# EAGLE design fastkey - v2 (EAGLE 9.2.2)
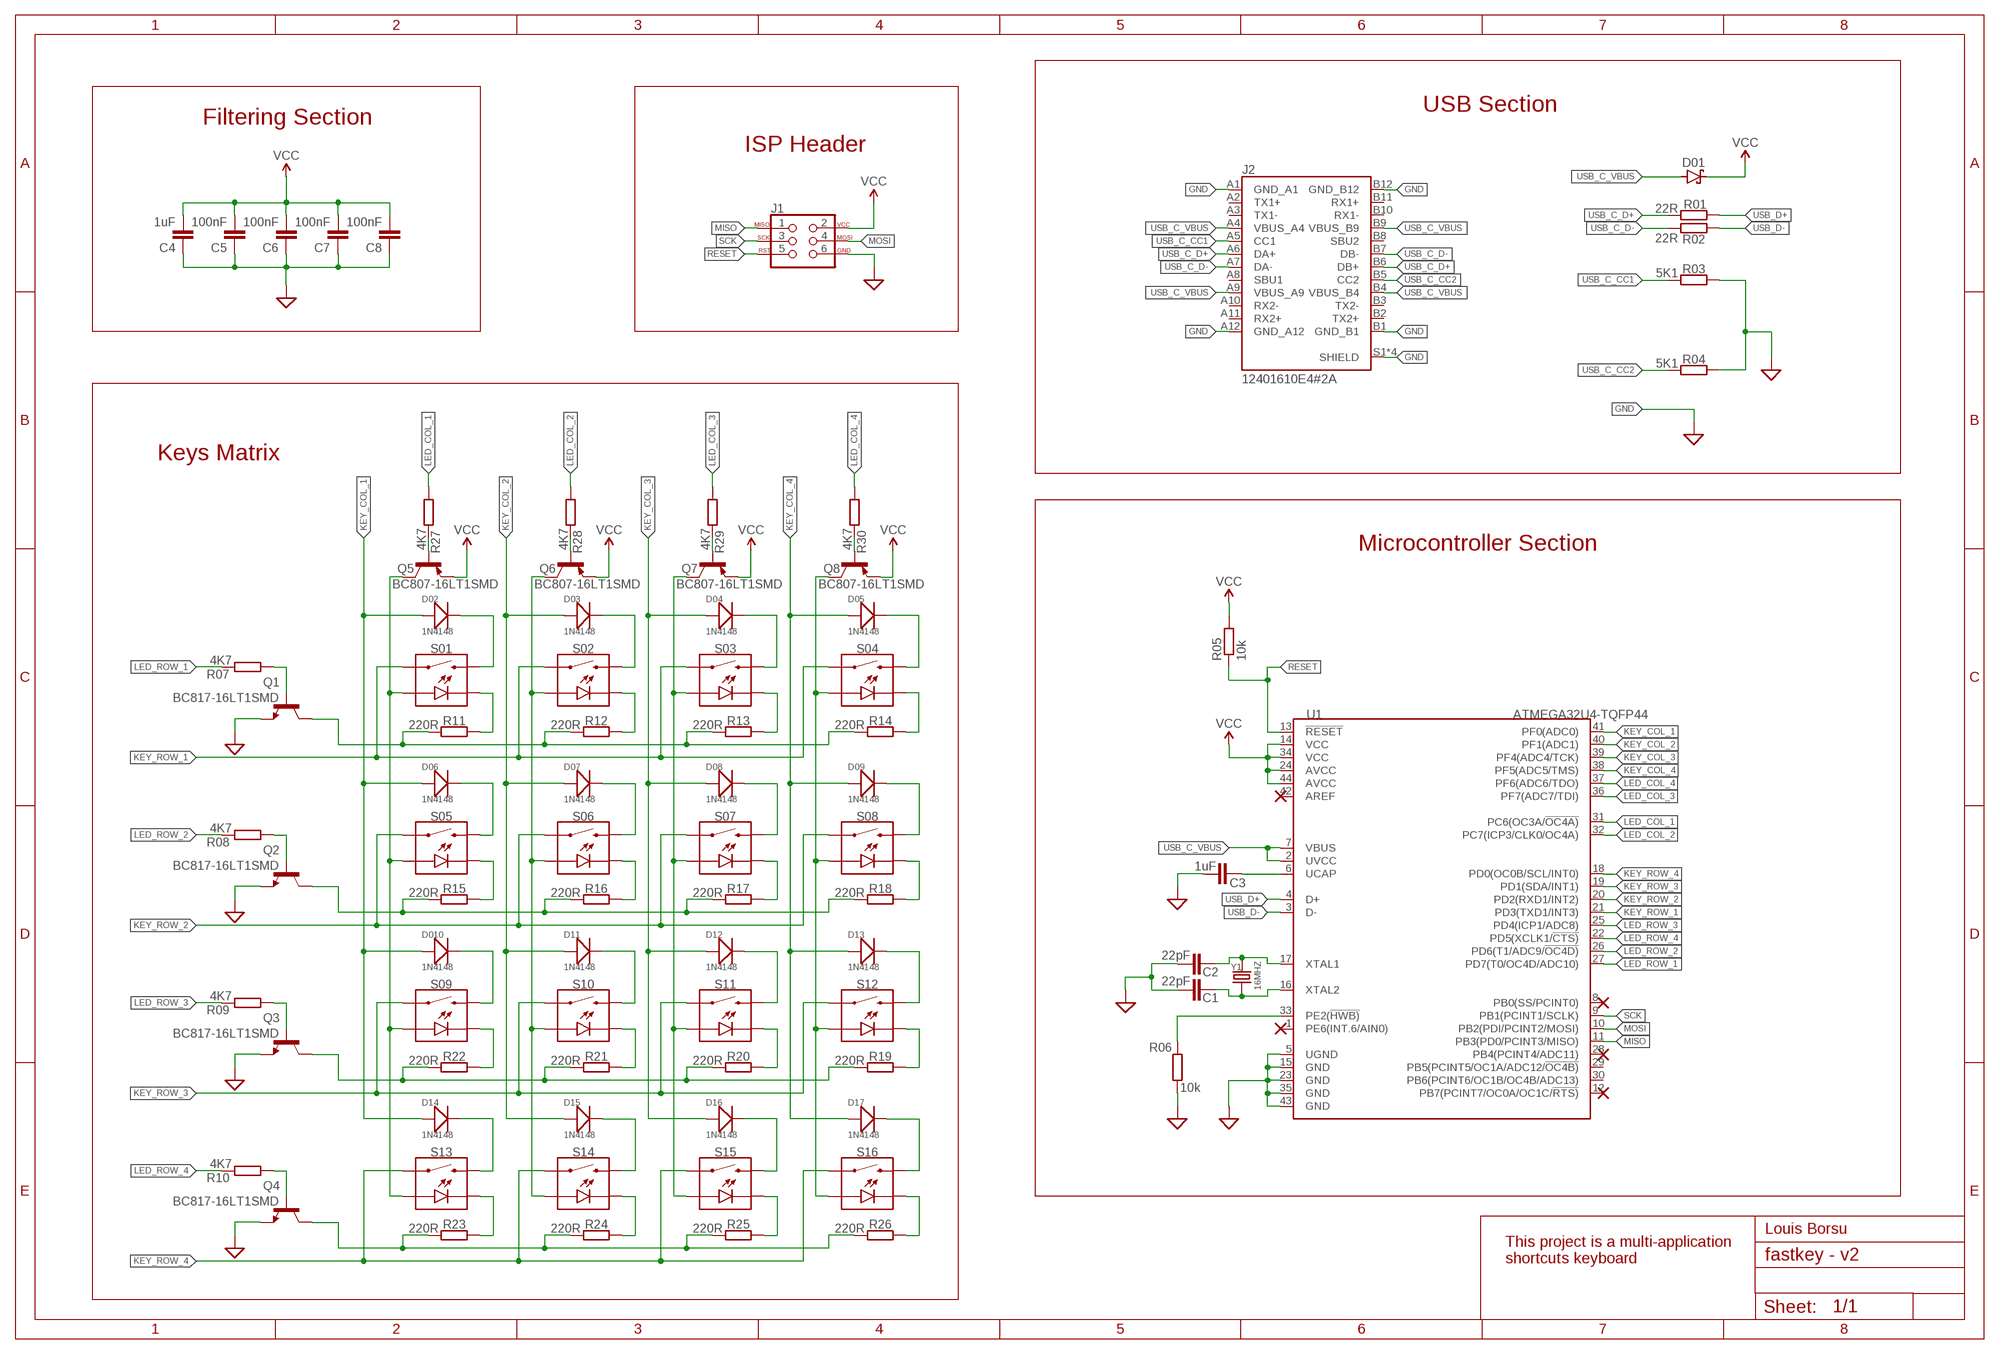
[diagram p0: schematic, sheet 1]

## Parts
C1  22pF  CAPACITOR_0805_M  [RESC0805_M]
C2  22pF  CAPACITOR_0805_M  [RESC0805_M]
C3  1uF  CAPACITOR_0805_M  [RESC0805_M]
C4  1uF  CAPACITOR_0805_M  [RESC0805_M]
C5  100nF  CAPACITOR_0805_M  [RESC0805_M]
C6  100nF  CAPACITOR_0805_M  [RESC0805_M]
C7  100nF  CAPACITOR_0805_M  [RESC0805_M]
C8  100nF  CAPACITOR_0805_M  [RESC0805_M]
D01  SCHOTTKY-DIODESMD  [SMB]
D02  1N4148  SMD-DIODE-SWITCH-1N4148(LL-34)  [LL-34]
D03  1N4148  SMD-DIODE-SWITCH-1N4148(LL-34)  [LL-34]
D04  1N4148  SMD-DIODE-SWITCH-1N4148(LL-34)  [LL-34]
D05  1N4148  SMD-DIODE-SWITCH-1N4148(LL-34)  [LL-34]
D06  1N4148  SMD-DIODE-SWITCH-1N4148(LL-34)  [LL-34]
D07  1N4148  SMD-DIODE-SWITCH-1N4148(LL-34)  [LL-34]
D08  1N4148  SMD-DIODE-SWITCH-1N4148(LL-34)  [LL-34]
D09  1N4148  SMD-DIODE-SWITCH-1N4148(LL-34)  [LL-34]
D010  1N4148  SMD-DIODE-SWITCH-1N4148(LL-34)  [LL-34]
D11  1N4148  SMD-DIODE-SWITCH-1N4148(LL-34)  [LL-34]
D12  1N4148  SMD-DIODE-SWITCH-1N4148(LL-34)  [LL-34]
D13  1N4148  SMD-DIODE-SWITCH-1N4148(LL-34)  [LL-34]
D14  1N4148  SMD-DIODE-SWITCH-1N4148(LL-34)  [LL-34]
D15  1N4148  SMD-DIODE-SWITCH-1N4148(LL-34)  [LL-34]
D16  1N4148  SMD-DIODE-SWITCH-1N4148(LL-34)  [LL-34]
D17  1N4148  SMD-DIODE-SWITCH-1N4148(LL-34)  [LL-34]
J1  AVR_SPI_PROG_3X22X3_LOCK  [2X3_LOCK]
J2  12401610E4#2A  [AMPHENOL_12401610E4#2A]
Q1  BC817-16LT1SMD  [SOT23-BEC]
Q2  BC817-16LT1SMD  [SOT23-BEC]
Q3  BC817-16LT1SMD  [SOT23-BEC]
Q4  BC817-16LT1SMD  [SOT23-BEC]
Q5  BC807-16LT1SMD  [SOT23-BEC]
Q6  BC807-16LT1SMD  [SOT23-BEC]
Q7  BC807-16LT1SMD  [SOT23-BEC]
Q8  BC807-16LT1SMD  [SOT23-BEC]
R01  22R  R-EU_R0805  [R0805]
R02  22R  R-EU_R0805  [R0805]
R03  5K1  R-EU_R0805  [R0805]
R04  5K1  R-EU_R0805  [R0805]
R05  10k  R-EU_R0805  [R0805]
R06  10k  R-EU_R0805  [R0805]
R07  4K7  R-EU_R0805  [R0805]
R08  4K7  R-EU_R0805  [R0805]
R09  4K7  R-EU_R0805  [R0805]
R10  4K7  R-EU_R0805  [R0805]
R11  220R  R-EU_R0805  [R0805]
R12  220R  R-EU_R0805  [R0805]
R13  220R  R-EU_R0805  [R0805]
R14  220R  R-EU_R0805  [R0805]
R15  220R  R-EU_R0805  [R0805]
R16  220R  R-EU_R0805  [R0805]
R17  220R  R-EU_R0805  [R0805]
R18  220R  R-EU_R0805  [R0805]
R19  220R  R-EU_R0805  [R0805]
R20  220R  R-EU_R0805  [R0805]
R21  220R  R-EU_R0805  [R0805]
R22  220R  R-EU_R0805  [R0805]
R23  220R  R-EU_R0805  [R0805]
R24  220R  R-EU_R0805  [R0805]
R25  220R  R-EU_R0805  [R0805]
R26  220R  R-EU_R0805  [R0805]
R27  4K7  R-EU_R0805  [R0805]
R28  4K7  R-EU_R0805  [R0805]
R29  4K7  R-EU_R0805  [R0805]
R30  4K7  R-EU_R0805  [R0805]
S01  MOMENTARY-SWITCH-SPST-LED-PTH-CHERRY  [CHERRY-MX-LED]
S02  MOMENTARY-SWITCH-SPST-LED-PTH-CHERRY  [CHERRY-MX-LED]
S03  MOMENTARY-SWITCH-SPST-LED-PTH-CHERRY  [CHERRY-MX-LED]
S04  MOMENTARY-SWITCH-SPST-LED-PTH-CHERRY  [CHERRY-MX-LED]
S05  MOMENTARY-SWITCH-SPST-LED-PTH-CHERRY  [CHERRY-MX-LED]
S06  MOMENTARY-SWITCH-SPST-LED-PTH-CHERRY  [CHERRY-MX-LED]
S07  MOMENTARY-SWITCH-SPST-LED-PTH-CHERRY  [CHERRY-MX-LED]
S08  MOMENTARY-SWITCH-SPST-LED-PTH-CHERRY  [CHERRY-MX-LED]
S09  MOMENTARY-SWITCH-SPST-LED-PTH-CHERRY  [CHERRY-MX-LED]
S10  MOMENTARY-SWITCH-SPST-LED-PTH-CHERRY  [CHERRY-MX-LED]
S11  MOMENTARY-SWITCH-SPST-LED-PTH-CHERRY  [CHERRY-MX-LED]
S12  MOMENTARY-SWITCH-SPST-LED-PTH-CHERRY  [CHERRY-MX-LED]
S13  MOMENTARY-SWITCH-SPST-LED-PTH-CHERRY  [CHERRY-MX-LED]
S14  MOMENTARY-SWITCH-SPST-LED-PTH-CHERRY  [CHERRY-MX-LED]
S15  MOMENTARY-SWITCH-SPST-LED-PTH-CHERRY  [CHERRY-MX-LED]
S16  MOMENTARY-SWITCH-SPST-LED-PTH-CHERRY  [CHERRY-MX-LED]
U1  ATMEGA32U4-TQFP44  MCU-ATMEGA32U4-AU(TQFP44)  [TQFP44-0.8-9.6X9.6MM]
Y1  16MHZ  SMD-CRYSTAL-16MHZ-8PF-20PPM-40R(2P-5.0X3.2MM)  [X2-SMD-5.0X3.2X1.3MM]

## Nets
GND: C1.1 C2.1 C3.1 C4.1 C5.1 C6.1 C7.1 C8.1 J1.6 J2.A1(GND_A1) J2.A12(GND_A12) J2.B1(GND_B1) J2.B12(GND_B12) J2.S1(SHIELD) J2.S2(SHIELD) J2.S3(SHIELD) J2.S4(SHIELD) Q1.E Q2.E Q3.E Q4.E R03.1 R04.1 R06.1 U1.5(UGND) U1.15(GND) U1.23(GND) U1.35(GND) U1.43(GND) ; supply symbol labelled SUP
KEY_COL_1: D02.A(+) D06.A(+) D010.A(+) D14.A(+) U1.41(PF0(ADC0))
KEY_COL_2: D03.A(+) D07.A(+) D11.A(+) D15.A(+) U1.40(PF1(ADC1))
KEY_COL_3: D04.A(+) D08.A(+) D12.A(+) D16.A(+) U1.39(PF4(ADC4/TCK))
KEY_COL_4: D05.A(+) D09.A(+) D13.A(+) D17.A(+) U1.38(PF5(ADC5/TMS))
KEY_ROW_1: S01.S1 S02.S1 S03.S1 S04.S1 U1.21(PD3(TXD1/INT3))
KEY_ROW_2: S05.S1 S06.S1 S07.S1 S08.S1 U1.20(PD2(RXD1/INT2))
KEY_ROW_3: S09.S1 S10.S1 S11.S1 S12.S1 U1.19(PD1(SDA/INT1))
KEY_ROW_4: S13.S1 S14.S1 S15.S1 S16.S1 U1.18(PD0(OC0B/SCL/INT0))
LED_COL_1: R27.1 U1.31(PC6(OC3A/!OC4A))
LED_COL_1_PR: Q5.C S01.A S05.A S09.A S13.A
LED_COL_2: R28.1 U1.32(PC7(ICP3/CLK0/OC4A))
LED_COL_2_PR: Q6.C S02.A S06.A S10.A S14.A
LED_COL_3: R29.1 U1.36(PF7(ADC7/TDI))
LED_COL_3_PR: Q7.C S03.A S07.A S11.A S15.A
LED_COL_4: R30.1 U1.37(PF6(ADC6/TDO))
LED_COL_4_PR: Q8.C S04.A S08.A S12.A S16.A
LED_ROW_1: R07.2 U1.27(PD7(T0/OC4D/ADC10))
LED_ROW_1_PR: Q1.C R11.2 R12.2 R13.2 R14.2
LED_ROW_2: R08.2 U1.26(PD6(T1/ADC9/!OC4D))
LED_ROW_2_PR: Q2.C R15.2 R16.2 R17.2 R18.2
LED_ROW_3: R09.2 U1.25(PD4(ICP1/ADC8))
LED_ROW_3_PR: Q3.C R19.2 R20.2 R21.2 R22.2
LED_ROW_4: R10.2 U1.22(PD5(XCLK1/!CTS))
LED_ROW_4_PR: Q4.C R23.2 R24.2 R25.2 R26.2
MISO: J1.1 U1.11(PB3(PD0/PCINT3/MISO))
MOSI: J1.4 U1.10(PB2(PDI/PCINT2/MOSI))
N$1: C2.2 U1.17(XTAL1) Y1.2
N$2: R11.1 S01.K(C)
N$3: R12.1 S02.K(C)
N$4: R24.1 S14.K(C)
N$5: R25.1 S15.K(C)
N$6: C1.2 U1.16(XTAL2) Y1.1
N$7: R26.1 S16.K(C)
N$8: R19.1 S12.K(C)
N$9: R20.1 S11.K(C)
N$10: R21.1 S10.K(C)
N$11: D02.C(-) S01.S2
N$12: R22.1 S09.K(C)
N$13: R15.1 S05.K(C)
N$14: R16.1 S06.K(C)
N$15: R17.1 S07.K(C)
N$16: R18.1 S08.K(C)
N$17: R14.1 S04.K(C)
N$18: R13.1 S03.K(C)
N$19: Q1.B R07.1
N$20: Q2.B R08.1
N$21: C3.2 U1.6(UCAP)
N$22: R06.2 U1.33(PE2(!HWB))
N$23: Q5.B R27.2
N$24: Q6.B R28.2
N$25: Q7.B R29.2
N$26: D04.C(-) S03.S2
N$27: Q8.B R30.2
N$28: Q3.B R09.1
N$29: R23.1 S13.K(C)
N$30: Q4.B R10.1
N$36: D03.C(-) S02.S2
N$39: D05.C(-) S04.S2
N$44: D06.C(-) S05.S2
N$45: D07.C(-) S06.S2
N$46: D08.C(-) S07.S2
N$47: D09.C(-) S08.S2
N$48: D010.C(-) S09.S2
N$50: D11.C(-) S10.S2
N$51: D15.C(-) S14.S2
N$53: D12.C(-) S11.S2
N$54: D14.C(-) S13.S2
N$55: D16.C(-) S15.S2
N$56: D13.C(-) S12.S2
N$57: D17.C(-) S16.S2
RESET: J1.5 R05.1 U1.13(!RESET)
SCK: J1.3 U1.9(PB1(PCINT1/SCLK))
USB_C_CC1: J2.A5(CC1) R03.2
USB_C_CC2: J2.B5(CC2) R04.2
USB_C_D+: J2.A6(DA+) J2.B6(DB+) R01.2
USB_C_D-: J2.A7(DA-) J2.B7(DB-) R02.2
USB_C_VBUS: D01.A J2.A4(VBUS_A4) J2.A9(VBUS_A9) J2.B4(VBUS_B4) J2.B9(VBUS_B9) U1.2(UVCC) U1.7(VBUS)
USB_D+: R01.1 U1.4(D+)
USB_D-: R02.1 U1.3(D-)
VCC [VCC]: C4.2 C5.2 C6.2 C7.2 C8.2 D01.C J1.2 Q5.E Q6.E Q7.E Q8.E R05.2 U1.14(VCC) U1.24(AVCC) U1.34(VCC) U1.44(AVCC)
Unconnected: J2.A2(TX1+) J2.A3(TX1-) J2.A8(SBU1) J2.A10(RX2-) J2.A11(RX2+) J2.B2(TX2+) J2.B3(TX2-) J2.B8(SBU2) J2.B10(RX1-) J2.B11(RX1+) U1.1(PE6(INT.6/AIN0)) U1.8(PB0(SS/PCINT0)) U1.12(PB7(PCINT7/OC0A/OC1C/!RTS)) U1.28(PB4(PCINT4/ADC11)) U1.29(PB5(PCINT5/OC1A/ADC12/!OC4B)) U1.30(PB6(PCINT6/OC1B/OC4B/ADC13)) U1.42(AREF)

## Notes on the sheet
- USB Section
- Filtering Section
- ISP Header
- Keys Matrix
- Microcontroller Section
- Louis Borsu
- This project is a multi-application
  shortcuts keyboard

## Library data of the parts
C1-C5 C7 C8 = Nordic_nRF:CAPACITOR: Generic chip capacitor; SPICEPREFIX: C
C6 = Nordic_nRF:CAPACITOR: Generic chip capacitor
D01 = diode:SCHOTTKY-DIODE: Schottky Diode
D02-D010 D11-D17 = Seeed-Diode:SMD-DIODE-SWITCH-1N4148(LL-34): 304040016; MPN: 1N4148
J1 = SparkFun-Connectors:AVR_SPI_PROG_3X2: AVR ISP 6 Pin This is the reduced ISP connector for AVR programming. Common on Arduino. This footprint will take up less PCB space and can be used with a 10-pin to 6-pin adapter such as SKU: BOB-08508 **Special note about "TEST_POINT" package. The stop mask is on the top side, so if you want your programming test points to be on the bottom of your board, make sure to place this package on the bottom side of the board. This also ensure that the orientation to program from the bottom side will be correct. SparkFun Products: SparkFun ISP Pogo Adapter <https://www.sparkfun.com/products/11591> - NS Tiny AVR Programmer <https://www.sparkfun.com/products/11801> -PTH
J2 = 12401610E4_2A:12401610E4#2A: Usb Type-c, Ra Rcpt, Pcb Mount,; DESCRIPTION: Conn USB Type C Surface Mount Receptacle; DIGI-KEY_PART_NUMBER: 12401610E4#2ACT-ND; DIGI-KEY_PURCHASE_URL: https://www.digikey.com/product-detail/en/amphenol-icc-commercial-products/12401610E4-2A/12401610E4-2ACT-ND/5775520?utm_source=snapeda&utm_medium=aggregator&utm_campaign=symbol; MF: Amphenol ICC; MP: 12401610E4#2A; PACKAGE: None
Q1-Q4 = transistor-npn:BC817*: NPN Transistor
Q5-Q8 = transistor-pnp:BC807*: PNP Transistror
R01-R09 R10-R30 = rcl:R-EU_: RESISTOR, European symbol; SPICEPREFIX: R
S01-S09 S10-S16 = SparkFun-Switches:MOMENTARY-SWITCH-SPST-LED: Momentary Switch (Pushbutton) - SPST - w/ LED Normally-open (NO) SPST momentary switches (buttons, pushbuttons), with a built-in LED. Variants PTH-CHERRY - Cherry MX Switch Cherry MX Keyswitches are top-of-the-line mechanical keyboard switches. They’re satisfyingly “clicky”, reliable up to tens-of-millions of key presses, and a standard in gaming and programming keyboards across the globe. This ‘blue’ version Cherry MX Switch is favored by most due to its secondary internal actuator making it less likely to “double-tap.” If you are looking for a noticeably audible and high-quality key switch, this is the perfect option for you! Cherry MX Switch <https://www.sparkfun.com/products/13834> (COM-13834) Cherry MX Switch Breakout <https://www.sparkfun.com/products/13773> (BOB-13773) PTH-12MM and PTH-12MM-KIT - 12mm Illuminated LED KIT variant is for soldering kits. There is no tStop (covering up the top side of the pads with mask). This helps the beginner see which side they should be soldering too. LED Tactile Button Breakout <https://www.sparkfun.com/products/10467> (BOB-10467) LED Tactile Button - Red <https://www.sparkfun.com/products/10442> (COM-10442) LED Tactile Button - Blue <https://www.sparkfun.com/products/10443> (COM-10443) LED Tactile Button - Green <https://www.sparkfun.com/products/10440> (COM-10440) LED Tactile Button - Orange <https://www.sparkfun.com/products/10441> (COM-10441) LED Tactile Button - White <https://www.sparkfun.com/products/10439> (COM-10439); SF_ID: COM-13834
U1 = Seeed-IC:MCU-ATMEGA32U4-AU(TQFP44): 310010010; MPN: ATMEGA32U4
Y1 = Seeed-Crystal Oscillator:SMD-CRYSTAL-16MHZ-8PF-20PPM-40R(2P-5.0X3.2MM): 306010054; MPN: X053201602002

## Net classes
1 VCC: width 0.406 mm

## Board
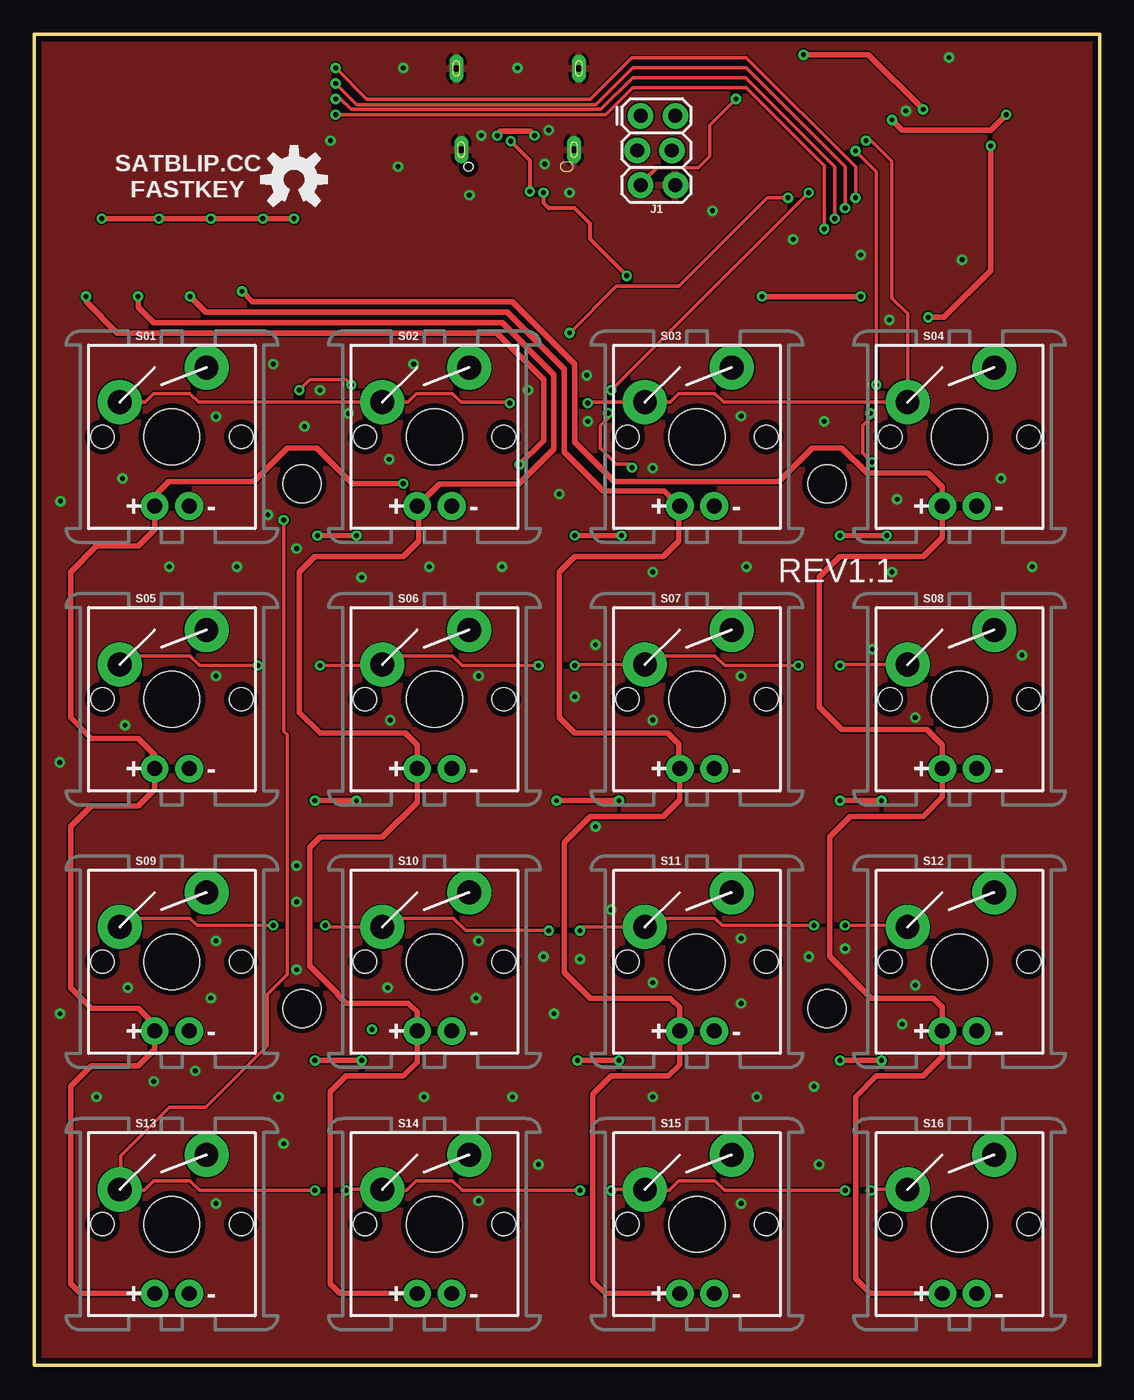
[diagram p1: board, top side]
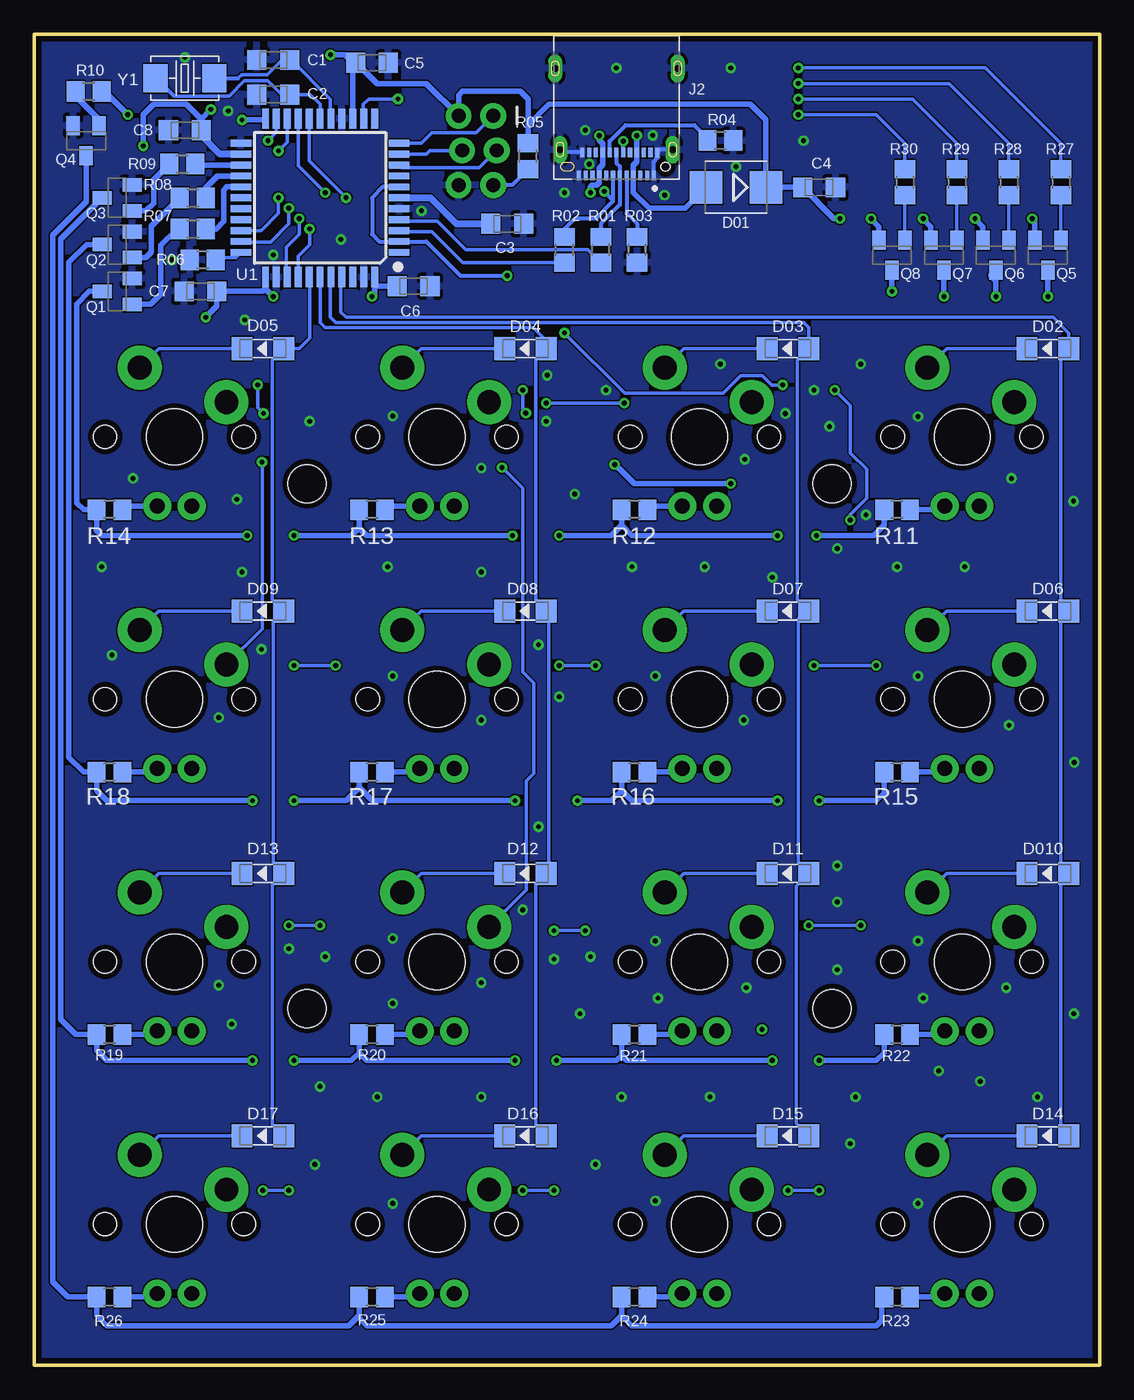
[diagram p2: board, bottom side, seen from below]

Size 78.11 x 97.6 mm. Coordinates in mm from the lower left corner, seen from the top.
Outline: 0,0 78.11,0 78.11,97.6 0,97.6 0,0
Copper layers (1*16): Top 0.035mm / dielectric 1.5mm / Bottom 0.035mm
Design rules "default *": minimum track width 3.5mil, minimum drill 0.2mm, track to track 4mil, track to pad 5mil, pad to pad 5mil, via to via 5mil, smd to smd 4mil, copper to edge 0.4mm, drill to drill 6mil, minimum pad ring 10mil, minimum via ring 8mil, stop-mask expansion 4mil, vias tented up to drill 14mil, thermal gap 10mil
Holes 2.79 mm at 19.62,64.64 58.1,64.64 19.62,26.16 58.1,26.16

### Footprints (pad centres in the part's own frame; a part is rotated, then mirrored left to right if it is on the bottom)
RESC0805_M = smd 1.4 x 1.45: 1 -1.2,0; 2 1.2,0
SMB = smd 2.4 x 2.4: A 2.2,0; C -2.2,0
LL-34 = smd 1.524 x 1.676: A -1.524,0; C 1.524,0
2X3_LOCK = drill 1.016 pad 1.88: 1 0,0.127; 2 0,2.667; 3 2.54,-0.127; 4 2.54,2.413; 5 5.08,0.127; 6 5.08,2.667
AMPHENOL_12401610E4#2A = smd 0.3 x 0.7: A1 -2.75,0.66; A2 -2.25,0.66; A3 -1.75,0.66; A4 -1.25,0.66; A5 -0.75,0.66; A6 -0.25,0.66; A7 0.25,0.66; A8 0.75,0.66; A9 1.25,0.66; A10 1.75,0.66; A11 2.25,0.66; A12 2.75,0.66; B1 2.5,-1.04; B2 2,-1.04; B3 1.5,-1.04; B4 1,-1.04; B5 0.5,-1.04; B6 0,-1.04; B7 -0.5,-1.04; B8 -1,-1.04; B9 -1.5,-1.04; B10 -2,-1.04; B11 -2.5,-1.04; B12 -3,-1.04 | drill 0.5 pad 0.8 long: S1 -4.13,-1.25; S2 4.13,-1.25; S3 4.49,-7.2; S4 -4.49,-7.2 | hole 0.65: -3.6,0
SOT23-BEC = smd 1 x 1.4: B -0.95,-1.1; C 0,1.1; E 0.95,-1.1
R0805 = smd 1.3 x 1.5: 1 -0.95,0; 2 0.95,0
CHERRY-MX-LED = drill 1.092 pad 2.032: A -1.27,-5.08; K 1.27,-5.08 | drill 1.753 pad 3.226: S1 -3.81,2.54; S2 2.54,5.08 | hole 4.089: 0,0 | hole 1.707: -5.08,0; 5.08,0
TQFP44-0.8-9.6X9.6MM = smd 1.5 x 0.5: 1 -5.8,4; 2 -5.8,3.2; 3 -5.8,2.4; 4 -5.8,1.6; 5 -5.8,0.8; 6 -5.8,0; 7 -5.8,-0.8; 8 -5.8,-1.6; 9 -5.8,-2.4; 10 -5.8,-3.2; 11 -5.8,-4; 23 5.8,-4; 24 5.8,-3.2; 25 5.8,-2.4; 26 5.8,-1.6; 27 5.8,-0.8; 28 5.8,0; 29 5.8,0.8; 30 5.8,1.6; 31 5.8,2.4; 32 5.8,3.2; 33 5.8,4 | smd 0.5 x 1.5: 12 -4,-5.8; 13 -3.2,-5.8; 14 -2.4,-5.8; 15 -1.6,-5.8; 16 -0.8,-5.8; 17 0,-5.8; 18 0.8,-5.8; 19 1.6,-5.8; 20 2.4,-5.8; 21 3.2,-5.8; 22 4,-5.8; 34 4,5.8; 35 3.2,5.8; 36 2.4,5.8; 37 1.6,5.8; 38 0.8,5.8; 39 0,5.8; 40 -0.8,5.8; 41 -1.6,5.8; 42 -2.4,5.8; 43 -3.2,5.8; 44 -4,5.8
X2-SMD-5.0X3.2X1.3MM = smd 1.778 x 2.032: 1 -2.159,0; 2 2.159,0

### Placement (x,y rotation side)
C1  60.59,95.71 0 bottom
C2  60.59,93.16 0 bottom
C3  43.43,83.69 180 bottom
C4  20.57,86.36 180 bottom
C5  53.34,95.5 180 bottom
C6  50.29,79.12 180 bottom
C7  65.91,78.74 0 bottom
C8  67.06,90.55 0 bottom
D01  26.67,86.36 180 bottom
D02  3.81,74.55 180 bottom
D03  22.86,74.55 180 bottom
D04  42.1,74.55 180 bottom
D05  61.34,74.55 180 bottom
D06  3.81,55.31 180 bottom
D07  22.86,55.31 180 bottom
D08  42.1,55.31 180 bottom
D09  61.34,55.31 180 bottom
D010  3.81,36.07 180 bottom
D11  22.86,36.07 180 bottom
D12  42.1,36.07 180 bottom
D13  61.34,36.07 180 bottom
D14  3.81,16.83 180 bottom
D15  22.86,16.83 180 bottom
D16  42.1,16.83 180 bottom
D17  61.34,16.83 180 bottom
J1  44.33,91.61 270 top
J2  35.43,87.88 180 bottom
Q1  72.01,78.74 90 bottom
Q2  72.01,82.17 90 bottom
Q3  72.01,85.6 90 bottom
Q4  74.3,89.79 180 bottom
Q5  3.81,81.41 180 bottom
Q6  7.62,81.41 180 bottom
Q7  11.43,81.41 180 bottom
Q8  15.24,81.41 180 bottom
R01  36.58,81.79 90 bottom
R02  39.24,81.79 90 bottom
R03  33.91,81.79 90 bottom
R04  27.81,89.79 180 bottom
R05  41.91,88.65 90 bottom
R06  65.75,81.06 0 bottom
R07  66.48,83.31 0 bottom
R08  66.48,85.6 0 bottom
R09  67.25,88.07 0 bottom
R10  74.1,93.41 0 bottom
R11  14.86,62.74 180 bottom
R12  34.1,62.74 180 bottom
R13  53.34,62.74 180 bottom
R14  72.58,62.74 180 bottom
R15  14.86,43.5 180 bottom
R16  34.1,43.5 180 bottom
R17  53.34,43.5 180 bottom
R18  72.58,43.5 180 bottom
R19  72.58,24.26 180 bottom
R20  53.34,24.26 180 bottom
R21  34.1,24.26 180 bottom
R22  14.86,24.26 180 bottom
R23  14.86,5.02 180 bottom
R24  34.1,5.02 180 bottom
R25  53.34,5.02 180 bottom
R26  72.58,5.02 180 bottom
R27  2.86,86.74 270 bottom
R28  6.67,86.74 270 bottom
R29  10.48,86.74 270 bottom
R30  14.29,86.74 270 bottom
S01  10.1,68.07 0 top
S02  29.34,68.07 0 top
S03  48.58,68.07 0 top
S04  67.82,68.07 0 top
S05  10.1,48.83 0 top
S06  29.34,48.83 0 top
S07  48.58,48.83 0 top
S08  67.82,48.83 0 top
S09  10.1,29.59 0 top
S10  29.34,29.59 0 top
S11  48.58,29.59 0 top
S12  67.82,29.59 0 top
S13  10.1,10.35 0 top
S14  29.34,10.35 0 top
S15  48.58,10.35 0 top
S16  67.82,10.35 0 top
U1  57.15,85.6 180 bottom
U$1  [OSHW-LOGO-M]  19.05,86.93 0 top
Y1  67.06,94.36 180 bottom

### Tracks (layer width: path | path; a pad name or v marks a point on that pad's centre or on a via)
GND  (via drill 0.35)
  Bottom 0.305: J2.B1 39.35,88.92 J2.S2 | J2.S1 32.22,89.13 J2.B12 32.38,88.88 32.38,88.56 32.68,88.26 J2.A1
  other vias: 55.63,82.55 62.67,76.64 6.48,65.02 13.33,69.56 19.81,68.83 26.03,66.43 27.81,73.41 17.53,73.41 9.91,58.55 14.86,58.55 19.24,59.88 24,57.78 28.96,58.55 34.29,58.55 38.48,63.88 45.34,58.17 52.2,58.55 45.34,65.79 57.91,69.22 40.58,69.22 39.62,49.02 6.67,46.93 13.34,50.55 26.1,47.31 32.58,50.55 45.34,47.31 51.82,50.55 64.58,47.5 51.82,69.6 20.95,71.5 6.86,27.69 12.95,26.92 13.34,31.11 11.81,21.59 8.76,20.83 4.57,19.68 17.91,19.68 18.29,16.26 28.57,19.68 35.05,19.68 36.96,14.73 38.1,25.78 37.34,29.97 32.58,31.11 25.91,27.69 32.38,26.92 45.34,19.68 52.96,19.68 57.15,20.45 57.53,14.73 45.34,28.07 51.82,31.31 51.82,26.54 56.77,29.97 63.63,25.02 19.24,29.02 40.01,29.78 59.44,30.54 64.58,27.88 13.34,11.87 32.58,12.06 51.82,11.87 19.24,36.64 19.24,33.97 27.05,95.12 35.43,95.12 37.72,90.55 26.67,87.88 21.72,89.79 32.77,90.17 39.24,85.98 31.9,85.79 49.72,84.65 63.25,63.5 70.87,65.02 73.15,58.55 62.87,58.17 72.39,52.07 60.58,81.41 68.01,81.06 67.06,95.88 63.89,91.96 1.94,63.36 1.88,44.21 1.91,25.78 41.15,52.83 41.15,39.5 42.29,33.4 36.2,71.5 40.5,72.59 61.44,52.5 17.14,62.36 37.43,88.07 23.05,69.79
  pour Bottom: -0.76,98.17 79.06,98.17 79.06,-0.89 -0.76,-0.89
  pour Top: -0.76,98.17 79.06,98.17 79.06,-0.89 -0.76,-0.89
KEY_COL_1
  Bottom 0.254: U1.41 55.63,79.72 55.63,77.22 55.24,76.83 3.43,76.83 2.29,75.69 D02.A 2.86,73.98 2.86,55.88 D06.A 2.86,54.74 2.86,36.64 D010.A 2.86,35.5 2.86,17.4 D14.A
KEY_COL_2
  Bottom 0.254: U1.40 56.39,79.76 56.39,76.83 56.01,76.45 21.72,76.45 21.34,76.07 D03.A 22.18,73.7 22.18,56.15 D07.A 21.53,55.31 22.1,54.74 22.1,36.83 D11.A 22.25,35.16 22.25,17.74 D15.A
KEY_COL_3
  Bottom 0.254: U1.39 57.15,76.45 56.77,76.07 41.53,76.07 40.58,75.12 D04.A 41.34,73.79 41.34,56.07 D08.A 40.39,55.12 40.39,36.26 D12.A 41.34,35.31 41.34,17.59 D16.A
KEY_COL_4
  Bottom 0.254: U1.38 57.91,79.76 57.91,75.31 58.67,74.55 D05.A 60.66,73.71 60.66,56.15 D09.A 60.58,54.55 60.58,36.83 D13.A 60.64,35.24 60.64,17.65 D17.A
KEY_ROW_1  (via drill 0.35)
  Top 0.254: S01.S1 8.13,70.61 8.78,71.26 11.42,71.26 12.06,70.61 S02.S1 27.37,70.61 28.02,71.26 30.66,71.26 31.3,70.61 34.8,70.61 v34.86,70.55 | v40.58,70.55 40.64,70.61 S03.S1 46.61,70.61 47.26,71.26 49.9,71.26 50.55,70.61 S04.S1 64.01,77.09 62.87,78.23 62.87,88.27 61.34,89.79 v60.96,89.79
  Bottom 0.254: v34.86,70.55 v40.58,70.55 | v60.96,89.79 60.35,90.4 U1.21
KEY_ROW_2  (via drill 0.35)
  Top 0.254: S08.S1 59.12,51.37 v59.05,51.31 | v56.01,51.31 50.61,51.31 49.9,52.02 45.35,52.02 44.77,51.44 S07.S1 39.69,51.37 v39.62,51.31 | v36.96,51.31 31.37,51.31 30.66,52.02 26.11,52.02 25.53,51.44 S06.S1 25.46,51.31 v20.95,51.31 | v16.38,51.31 12.13,51.31 11.42,52.02 6.87,52.02 6.29,51.44 S05.S1 | v60.2,89.03 61.72,87.5 v61.72,71.88 | v61.29,69.8 61.29,69.44 60.74,68.9 60.74,66.89 v61.4,66.23
  Bottom 0.254: v59.05,51.31 v56.01,51.31 | v39.62,51.31 v36.96,51.31 | v20.95,51.31 v16.38,51.31 | v60.2,89.03 59.55,89.67 U1.20 | v61.72,71.88 61.72,70.23 v61.29,69.8 | v61.4,66.23 61.4,53.98 S08.S1
KEY_ROW_3  (via drill 0.35)
  Top 0.254: S12.S1 63.88,32.26 v59.44,32.26 | v57.15,32.26 50.42,32.26 49.9,32.78 45.41,32.78 S11.S1 40.26,32.13 v40.01,31.88 | v37.72,31.88 31.62,31.88 30.72,32.78 26.11,32.78 25.53,32.19 S10.S1 21.46,32.13 v21.34,32.26 | v17.53,32.26 11.94,32.26 11.42,32.78 6.93,32.78 S09.S1 | v56.77,85.98 v42.29,71.5 | v42.07,69.82 42.07,69.47 41.5,68.9 41.5,67.25 42.67,66.08 43.56,66.08 v43.81,65.82
  Bottom 0.254: v59.44,32.26 v57.15,32.26 | v40.01,31.88 v37.72,31.88 | v21.34,32.26 v17.53,32.26 | U1.19 58.75,87.96 v56.77,85.98 | v42.29,71.5 42.29,70.04 v42.07,69.82 | v43.81,65.82 42.29,64.3 42.29,50.83 41.5,50.04 41.5,43.39 42.04,42.86 42.04,34.86 S11.S1
KEY_ROW_4  (via drill 0.35)
  Top 0.254: S16.S1 61.4,12.89 v61.34,12.83 | v59.44,12.83 50.61,12.83 49.9,13.54 47.26,13.54 46.55,12.83 44.83,12.83 S15.S1 42.35,12.89 v42.29,12.83 | v40.01,12.83 31.37,12.83 30.66,13.54 28.02,13.54 27.3,12.83 25.59,12.83 S14.S1 22.92,12.89 v22.86,12.83 | 6.35,12.83 S13.S1 | v20.57,12.83 12.13,12.83 11.42,13.54 8.78,13.54 8.06,12.83 6.35,12.83 | v55.24,85.6 53.72,85.6 47.24,79.12 42.67,79.12 v39.24,75.69 | v23.24,71.88 22.86,72.26 20.19,72.26 v19.43,71.5 | v18.29,61.98 18.29,46.49 18.54,46.24 18.54,28.67 17.08,27.21 17.08,23.43 12.57,18.92 9.91,18.92 6.35,15.37 6.35,12.83
  Bottom 0.254: v61.34,12.83 v59.44,12.83 | v42.29,12.83 v40.01,12.83 | v22.86,12.83 v20.57,12.83 | U1.18 57.95,88.3 v55.24,85.6 | v23.24,71.88 24.05,71.88 24.74,72.57 26.32,72.57 27.62,71.27 34.82,71.27 v39.24,75.69 | v19.43,71.5 18.29,70.36 18.29,66.9 17.08,65.69 17.08,63.59 18.29,62.39 v18.29,61.98
LED_COL_1  (via drill 0.35)
  Top 0.254: v22.1,95.12 24.38,92.84 40.77,92.84 43.81,95.88 52.2,95.88 60.2,87.88 v60.2,85.6
  Bottom 0.254: R27.1 2.86,89.6 8.38,95.12 v22.1,95.12 | v60.2,85.6 60.2,84.45 61.45,83.2 U1.31
LED_COL_1_PR  (via drill 0.35)
  Top 0.406: S13.A 3.37,5.27 2.67,5.97 2.67,20.45 4.19,21.97 7.62,21.97 8.83,23.18 S09.A 8.83,24.95 7.62,26.16 4.19,26.16 2.67,27.69 2.67,39.5 4.19,41.02 7.62,41.02 8.83,42.23 S05.A 8.83,44.77 7.62,45.97 4.19,45.97 2.67,47.5 2.67,58.17 4.57,60.07 7.62,60.07 8.83,61.28 S01.A 8.83,63.75 9.88,64.81 16.09,64.81 18.54,67.26 20.71,67.26 23.32,64.64 v27.05,64.64 | v35.56,66.04 37.34,67.81 37.34,68.83 37.34,72.26 33.91,75.69 6.1,75.69 3.81,77.98 v3.81,78.36
  Bottom 0.406: v35.56,66.04 35.51,66.04 34.11,64.64 v27.05,64.64 | v3.81,78.36 Q5.C
LED_COL_2  (via drill 0.35)
  Top 0.254: v22.1,93.98 23.65,92.43 41.15,92.43 43.85,95.14 52.18,95.14 59.44,87.88 v59.44,84.84
  Bottom 0.254: R28.1 6.67,89.6 11.05,93.98 v22.1,93.98 | v59.44,84.84 59.44,83.69 60.77,82.36 62.91,82.36 U1.32
LED_COL_2_PR  (via drill 0.35)
  Top 0.406: S14.A 22.42,5.27 21.72,5.97 21.72,20.07 22.86,21.21 27.05,21.21 28.07,22.23 S10.A 28.07,25.91 27.43,26.54 22.86,26.54 22.24,27.16 22.24,27.25 20.19,29.29 20.19,37.97 20.95,38.73 25.53,38.73 28.07,41.28 S06.A 28.07,45.49 27.2,46.36 20.95,46.36 19.43,47.88 19.43,58.17 20.57,59.31 27.05,59.31 28.19,60.45 28.19,62.86 S02.A 29.69,64.62 35.53,64.62 38.1,67.18 38.1,72.64 34.29,76.45 8.76,76.45 7.62,77.6 v7.62,78.36
  Bottom 0.406: v7.62,78.36 7.62,79.5 8,79.88 8,79.93 Q6.C
LED_COL_3  (via drill 0.35)
  Top 0.254: v22.1,92.84 22.48,92.84 23.24,92.08 41.53,92.08 43.85,94.4 52.16,94.4 58.67,87.88 v58.67,84.07
  Bottom 0.254: R29.1 10.48,89.6 13.72,92.84 v22.1,92.84 | v58.67,84.07 58.67,82.93 59.63,81.98 59.63,79.88 U1.36
LED_COL_3_PR  (via drill 0.35)
  Top 0.406: S15.A 41.85,5.27 40.96,6.16 40.96,19.88 42.29,21.21 46.48,21.21 47.31,22.04 S11.A 47.31,26.25 46.63,26.92 40.77,26.92 38.86,28.83 38.86,38.35 40.77,40.26 46.1,40.26 47.31,41.47 S07.A 47.24,43.81 47.24,45.55 46.44,46.36 39.62,46.36 38.48,47.5 38.48,58.17 39.62,59.31 46.1,59.31 47.24,60.45 47.24,62.93 S03.A 46.19,64.11 41.73,64.11 38.86,66.97 38.86,73.02 34.67,77.22 12.57,77.22 v11.43,78.36
  Bottom 0.406: v11.43,78.36 Q7.C
LED_COL_4  (via drill 0.35)
  Top 0.254: v57.91,83.31 57.91,87.95 52.2,93.66 43.88,93.66 41.91,91.69 v22.1,91.69
  Bottom 0.254: R30.1 14.29,89.6 16.39,91.69 v22.1,91.69 | v57.91,83.31 57.91,82.17 58.75,81.33 U1.37
LED_COL_4_PR  (via drill 0.35)
  Top 0.406: S16.A 61.28,5.27 60.2,6.35 60.2,19.68 61.72,21.21 65.15,21.21 66.55,22.61 S12.A 66.55,26.29 66.51,26.33 66.47,26.33 65.89,26.9 61.36,26.9 58.29,29.97 58.29,38.73 59.82,40.26 65.15,40.26 66.55,41.66 S08.A 66.55,45.49 65.42,46.62 59.17,46.62 57.53,48.26 57.53,57.78 59.05,59.31 65.15,59.31 66.55,60.71 S04.A 66.55,64.39 65.53,65.41 61.04,65.41 59.19,67.26 57.02,67.26 54.57,64.81 42.51,64.81 39.62,67.69 39.62,73.41 35.05,77.98 16,77.98 v15.24,78.74
  Bottom 0.406: v15.24,78.74 Q8.C
LED_ROW_1
  Bottom 0.406: U1.27 63.97,86.4 64.2,86.17 64.2,83.88 64.77,83.31 R07.2
LED_ROW_1_PR  (via drill 0.35)
  Top 0.406: v20.77,60.83 v23.62,60.83 | v39.62,60.83 v43.05,60.83 | v59.05,60.83 v62.48,60.83
  Bottom 0.406: R11.2 15.81,61.59 16.57,60.83 v20.77,60.83 | v23.62,60.83 34.29,60.83 35.05,61.59 | 35.05,61.59 R12.2 | 35.05,61.59 35.81,60.83 v39.62,60.83 | v43.05,60.83 53.72,60.83 54.29,61.4 R13.2 54.29,61.41 54.86,60.83 v59.05,60.83 | v62.48,60.83 73.15,60.83 73.53,61.21 73.53,61.22 R14.2 74.49,62.74 74.98,63.23 74.98,77.82 74.06,78.74 Q1.C
LED_ROW_2
  Bottom 0.406: U1.26 64.69,87.2 65.53,86.36 R08.2
LED_ROW_2_PR  (via drill 0.35)
  Top 0.406: v20.57,41.4 v23.62,41.4 | v38.29,41.4 v42.86,41.4 | v59.05,41.4 v62.1,41.4
  Bottom 0.406: Q2.C 74.25,82.17 75.55,80.87 75.55,44.56 74.49,43.5 R18.2 73.53,42.16 72.77,41.4 v62.1,41.4 | R15.2 15.81,41.98 16.38,41.4 v20.57,41.4 | v23.62,41.4 34.29,41.4 35.05,42.16 | 35.05,42.16 R16.2 | 35.05,42.16 35.81,41.4 v38.29,41.4 | v42.86,41.4 53.34,41.4 54.29,42.35 | 54.29,42.35 R17.2 | 54.29,42.35 55.24,41.4 v59.05,41.4
LED_ROW_3
  Bottom 0.406: U1.25 66.22,88 R09.2
LED_ROW_3_PR  (via drill 0.35)
  Top 0.406: v20.57,22.35 v24,22.35 | v39.81,22.35 v42.86,22.35 | v59.05,22.35 v62.1,22.35
  Bottom 0.406: Q3.C 76.15,82.56 76.15,25.35 75.06,24.26 R19.2 73.53,23.11 72.77,22.35 v62.1,22.35 | R22.2 15.81,22.93 16.38,22.35 v20.57,22.35 | v24,22.35 34.67,22.35 35.05,22.73 | 35.05,22.73 35.05,22.74 R21.2 | 35.05,22.73 35.43,22.35 v39.81,22.35 | v42.86,22.35 53.72,22.35 54.29,22.92 | 54.29,22.92 R20.2 | 54.29,22.92 54.86,22.35 v59.05,22.35
LED_ROW_4  (via drill 0.35)
  Top 0.406: v62.87,91.31 63.63,90.55 70.1,90.55 v71.25,91.69
  Bottom 0.406: U1.22 61.23,91.31 v62.87,91.31 | v71.25,91.69 72.96,93.41 R10.2
LED_ROW_4_PR
  Bottom 0.406: Q4.C 74.3,85.32 76.75,82.87 76.75,6.13 75.63,5.02 R26.2 73.53,3.68 72.77,2.92 55.05,2.92 54.29,3.68 | R23.2 16,4.82 16,3.3 16.38,2.92 34.29,2.92 35.05,3.68 | 35.05,3.68 R24.2 | 35.05,3.68 35.81,2.92 53.72,2.92 54.29,3.49 54.29,3.68 | 54.29,3.68 R25.2
MISO
  Bottom 0.254: J1.1 45.7,90.36 48.96,90.36 49.72,89.6 U1.11
MOSI
  Bottom 0.254: J1.4 49.11,89.07 49.38,88.8 U1.10
N$1
  Bottom 0.254: U1.17 57.15,92.46 57.86,93.16 C2.2 59.98,93.16 60.98,94.17 62.69,94.17 63.8,93.06 67.82,93.06
  Bottom 0.305: 67.82,93.06 69.12,94.36 Y1.2
N$2
  Bottom 0.406: S01.K 11.62,62.74 R11.1
N$3
  Bottom 0.406: S02.K 32.9,62.99 R12.1
N$4
  Bottom 0.406: S14.K 30.86,5.02 R24.1
N$5
  Bottom 0.406: S15.K 50.1,5.02 R25.1
N$6
  Bottom 0.254: U1.16 56.39,91.44 56.39,92.84 59.26,95.71 C1.2 59.93,95.71 61.01,94.63 62.89,94.63 63.17,94.36
  Bottom 0.305: Y1.1 | Y1.1 63.17,94.36
N$7
  Bottom 0.406: S16.K 69.34,5.02 R26.1
N$8
  Bottom 0.406: S12.K 69.34,24.26 R19.1
N$9
  Bottom 0.406: S11.K 50.1,24.26 R20.1
N$10
  Bottom 0.406: S10.K 30.86,24.26 R21.1
N$11
  Bottom 0.254: D02.C 11.24,74.55 S01.S2
N$12
  Bottom 0.406: S09.K 11.62,24.26 R22.1
N$13
  Bottom 0.406: S05.K 11.62,43.5 R15.1
N$14
  Bottom 0.406: S06.K 30.86,43.5 R16.1
N$15
  Bottom 0.406: S07.K 50.1,43.5 R17.1
N$16
  Bottom 0.406: S08.K 69.34,43.5 R18.1
N$17
  Bottom 0.406: S04.K 71.38,62.99 R14.1
N$18
  Bottom 0.406: S03.K 52.14,62.99 R13.1
N$19
  Bottom 0.406: R07.1 67.62,83.31 68.81,82.12 68.81,78.55 69.58,77.79 Q1.B
N$20
  Bottom 0.406: R08.1 69.53,83.5 69.53,81.6 69.91,81.22 69.92,81.22 Q2.B
N$21
  Bottom 0.508: U1.6 49.06,85.6 47.16,83.69 C3.2
N$22
  Bottom 0.254: U1.33 63.33,81.22 64.64,81.22 R06.2
N$23
  Bottom 0.254: Q5.B R27.2
N$24
  Bottom 0.254: Q6.B R28.2
N$25
  Bottom 0.254: Q7.B R29.2
N$26
  Bottom 0.254: D04.C 49.72,74.55 S03.S2
N$27
  Bottom 0.254: Q8.B R30.2
N$28
  Bottom 0.406: R09.1 69.34,86.93 69.34,85.22 69.91,84.65 Q3.B
N$29
  Bottom 0.406: S13.K 11.62,5.02 R23.1
N$30
  Bottom 0.406: R10.1 75.06,93.03 73.34,91.32 Q4.B
N$33  (via drill 0.35)
  other vias: 24.77,24.64
N$36
  Bottom 0.254: D03.C 30.48,74.55 S02.S2
N$39
  Bottom 0.254: D05.C 68.96,74.55 S04.S2
N$44
  Bottom 0.254: D06.C 11.24,55.31 S05.S2
N$45
  Bottom 0.254: D07.C 30.48,55.31 S06.S2
N$46
  Bottom 0.254: D08.C 49.72,55.31 S07.S2
N$47
  Bottom 0.254: D09.C 68.96,55.31 S08.S2
N$48
  Bottom 0.254: D010.C 11.24,36.07 S09.S2
N$50
  Bottom 0.254: D11.C 30.48,36.07 S10.S2
N$51
  Bottom 0.254: D15.C 30.48,16.83 S14.S2
N$53
  Bottom 0.254: D12.C 49.72,36.07 S11.S2
N$54
  Bottom 0.254: D14.C 11.24,16.83 S13.S2
N$55
  Bottom 0.254: D16.C 49.72,16.83 S15.S2
N$56
  Bottom 0.254: S12.S2 68.96,36.07 D13.C
N$57
  Bottom 0.254: D17.C 68.96,16.83 S16.S2
RESET  (via drill 0.35)
  Top 0.254: v51.44,92.84 49.53,90.93 49.53,88.65 48.68,87.79 45.63,87.79
  Top 0.305: 45.63,87.79 44.45,86.62 J1.5
  Bottom 0.254: v51.44,92.84 53.58,92.84 53.97,92.44 53.97,91.42 U1.13
  Bottom 0.305: J1.5 43.08,86.53 R05.1
SCK
  Bottom 0.254: J1.3 45.47,87.79 51.15,87.79 U1.9
USB_C_CC1
  Bottom 0.305: J2.A5 34.68,84.47 33.91,83.69 R03.2
USB_C_CC2
  Bottom 0.305: J2.B5 35.93,89.76 34.76,90.93 29.72,90.93 28.76,89.98 R04.2
USB_C_D+
  Bottom 0.305: R01.2 36.58,83.69 35.18,85.09 J2.A6 35.18,87.9 35.43,88.15 J2.B6
USB_C_D-  (via drill 0.35)
  Top 0.305: v34.93,89.75 36.33,88.35 v36.33,86.06
  Bottom 0.305: J2.A7 35.68,85.41 | R02.2 39.24,83.31 38.48,84.07 36.96,84.07 35.68,85.35 35.68,85.41 | J2.B7 v34.93,89.75 | v36.33,86.06 35.68,85.41
USB_C_VBUS  (via drill 0.35)
  Top 0.305: v43.43,79.88 40.77,82.55 40.77,83.69 39.62,84.84 37.72,84.84 37.34,85.22 v37.34,85.98
  Top 0.406: v36.68,90.16 36.37,90.47 34.14,90.47 33.93,90.26 v33.93,90.15
  Bottom 0.305: J2.A4 | U1.7 52.54,86.4 53.34,85.6 53.34,82.93 52.81,82.4 U1.2 49.38,82.4 46.86,79.88 v43.43,79.88
  Bottom 0.406: J2.B9 33.93,88.23 34.19,87.98 J2.A4 | J2.A4 34.18,85.98 33.04,84.84 30.39,84.84 D01.A | v36.68,90.16 36.68,89.83 36.43,89.58 J2.B4 36.43,88.03 36.68,87.78 J2.A9 36.68,86.72 36.88,86.52 37.2,86.52 37.34,86.38 v37.34,85.98 | v33.93,90.15 J2.B9 | J2.B9
USB_D+
  Bottom 0.254: R01.1 37.53,81.79 46.48,81.79 48.58,83.88 51.24,83.88 U1.4
USB_D-
  Bottom 0.254: R02.1 46.67,80.84 48.96,83.12 51.27,83.12 U1.3
VCC  (via drill 0.35)
  Top 0.406: v4.95,84.07 v9.14,84.07 v12.95,84.07 v16.76,84.07 v19.05,84.07 | v53.34,78.36 v60.58,78.36 | v65.15,92.08 61.15,96.08 v56.39,96.08 | v65.53,76.83 66.67,76.83 70.1,80.26 v70.1,89.41
  Bottom 0.406: C6.2 53.15,79.12 U1.44 53.15,78.55 v53.34,78.36 | 54.75,95.5 C5.2 54.48,95.5 52.96,93.98 49.37,93.98 J1.2 46.99,93.13 46.72,93.41 42.48,93.41 41.91,92.84 41.91,90.93 | 54.75,95.5 U1.14 | 41.91,90.93 40.39,92.46 25.61,92.46 24.47,91.31 D01.C C4.2 19.49,84.07 v19.05,84.07 | 41.91,90.93 R05.2 | Q5.E 4.76,83.88 v4.95,84.07 | Q6.E 8.57,83.5 v9.14,84.07 | Q7.E 12.38,83.5 v12.95,84.07 | Q8.E 16.19,83.5 v16.76,84.07 | v60.58,78.36 61.15,78.93 U1.34 61.15,78.93 61.34,78.74 C7.2 64.71,77.65 v65.53,76.83 | C8.2 65.86,91.37 | 65.86,91.37 v65.15,92.08 | v56.39,96.08 55.32,96.08 54.75,95.5 | v70.1,89.41 70.1,91.69 69.34,92.46 66.94,92.46 65.86,91.37
  Bottom 0.508: U1.24 64.48,88.8 65.86,90.17 C8.2 | U1.14

### Text on the board
tPlace: REV1.1
tNames: SATBLIP.CC | FASTKEY